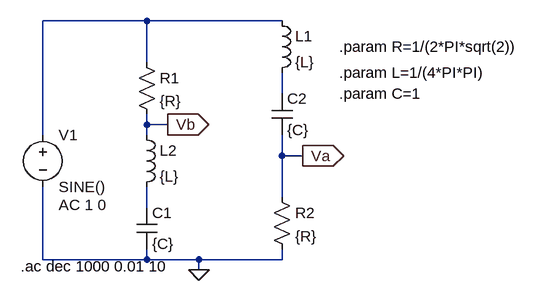
[diagram p0: schematic Lattice.asc]
Lattice.asc, the LTspice schematic file:
Version 4
SHEET 1 880 680
WIRE 96 -32 -64 -32
WIRE 304 -32 96 -32
WIRE 96 32 96 -32
WIRE 304 80 304 48
WIRE 96 128 96 112
WIRE 128 128 96 128
WIRE -64 144 -64 -32
WIRE 96 144 96 128
WIRE 304 176 304 144
WIRE 336 176 304 176
WIRE 304 240 304 176
WIRE 96 256 96 224
WIRE -64 336 -64 224
WIRE 96 336 96 320
WIRE 96 336 -64 336
WIRE 176 336 96 336
WIRE 304 336 304 320
WIRE 304 336 176 336
WIRE 176 352 176 336
FLAG 336 176 Va
IOPIN 336 176 Out
FLAG 128 128 Vb
IOPIN 128 128 Out
FLAG 176 352 0
SYMBOL res 80 16 R0
SYMATTR InstName R1
SYMATTR Value {R}
SYMBOL res 288 224 R0
SYMATTR InstName R2
SYMATTR Value {R}
SYMBOL ind 288 -48 R0
SYMATTR InstName L1
SYMATTR Value {L}
SYMBOL ind 80 128 R0
SYMATTR InstName L2
SYMATTR Value {L}
SYMBOL cap 80 256 R0
SYMATTR InstName C1
SYMATTR Value {C}
SYMBOL cap 288 80 R0
SYMATTR InstName C2
SYMATTR Value {C}
SYMBOL voltage -64 128 R0
WINDOW 123 24 124 Left 2
WINDOW 39 0 0 Left 0
SYMATTR InstName V1
SYMATTR Value SINE()
SYMATTR Value2 AC 1 0
TEXT -98 346 Left 2 !.ac dec 1000 0.01 10
TEXT 392 8 Left 2 !.param R=1/(2*PI*sqrt(2))
TEXT 392 48 Left 2 !.param L=1/(4*PI*PI)
TEXT 392 80 Left 2 !.param C=1

The netlist it stands for:
* Lattice.asc
R1 N001 Vb {R}
R2 Va 0 {R}
L1 N001 N002 {L}
L2 Vb N003 {L}
C1 N003 0 {C}
C2 N002 Va {C}
V1 N001 0 SINE() AC 1 0
.ac dec 1000 0.01 10
.param R=1/(2*PI*sqrt(2))
.param L=1/(4*PI*PI)
.param C=1
.backanno
.end

* Results of the author's LTspice run, read from the files saved beside the schematic
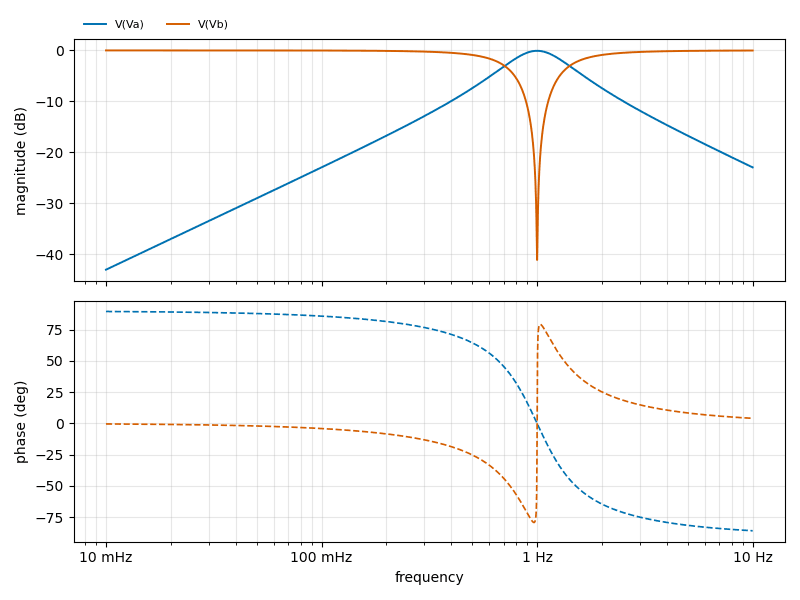
[diagram p1: AC Analysis of Lattice.asc, plotted from the saved traces]
* AC Analysis, 1 run:
*   V(Va): -43.01 dB at 10 mHz, -22.95 dB at 10 Hz, peak -0.08 dB at 1 Hz, 3 dB below the peak at 705 mHz and 1.418 Hz
*   V(Vb): -0.00 dB at 10 mHz, -0.02 dB at 10 Hz, peak -0.00 dB at 10 mHz, 3 dB below the peak at 705 mHz